# EAGLE design untitled (EAGLE 9.6.2)

## Sheet 1 of 2
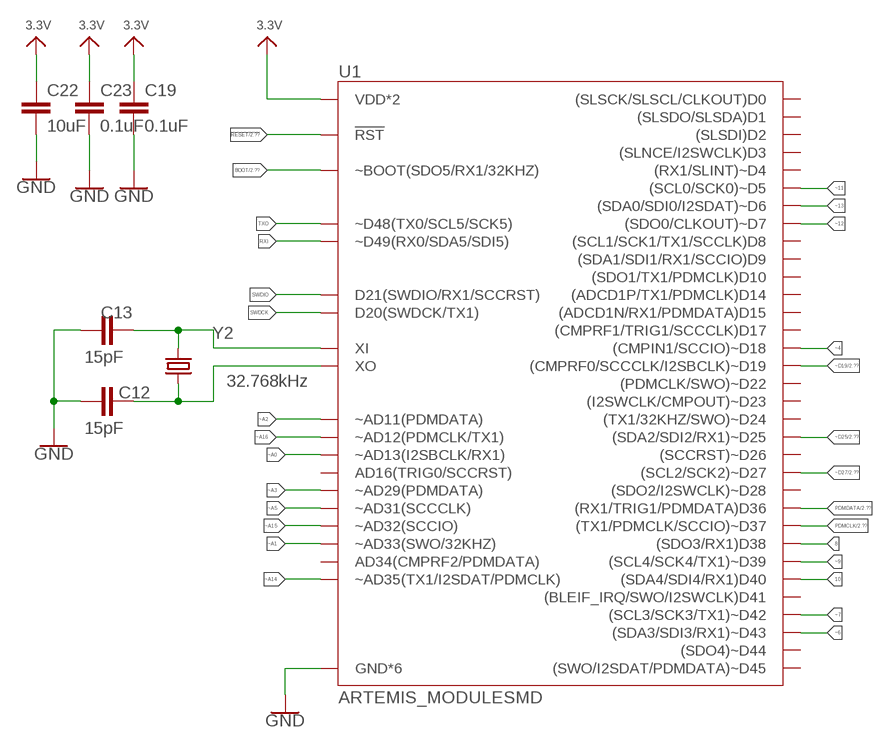
[diagram p0: schematic, sheet 1, part 1 of 2]
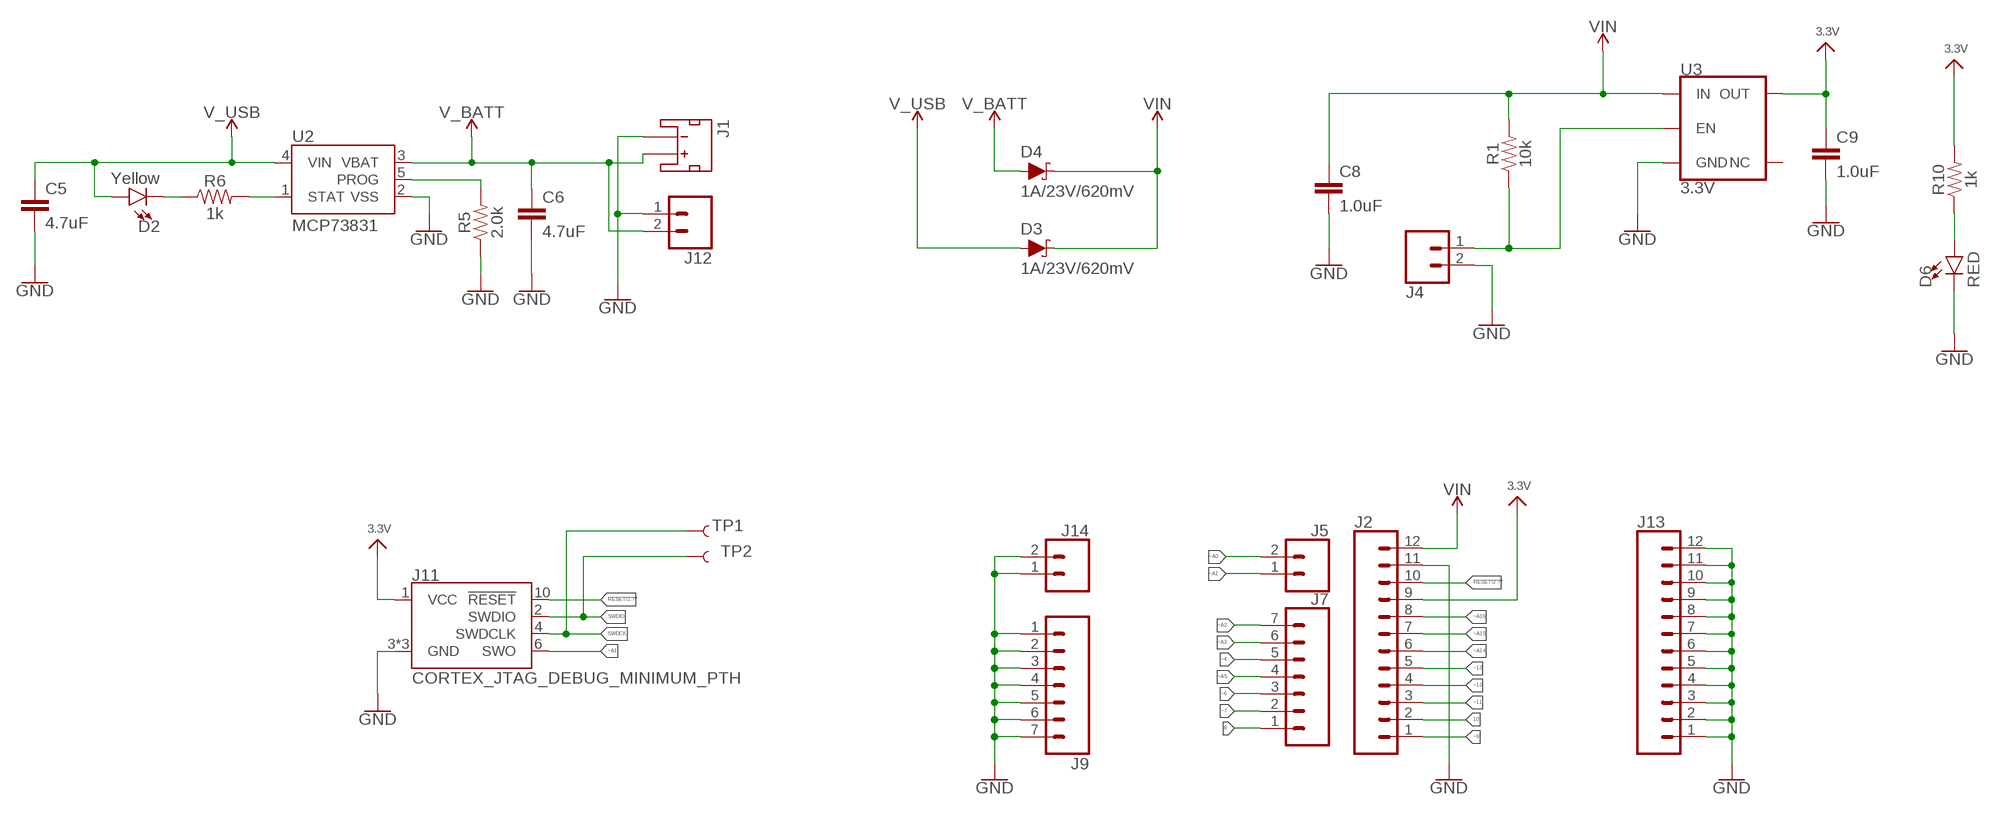
[diagram p1: schematic, sheet 1, part 2 of 2]

### Parts
C5  4.7uF  4.7UF-0603-6.3V-(10%)  [0603]
C6  4.7uF  4.7UF-0603-6.3V-(10%)  [0603]
C8  1.0uF  1.0UF-0402T-16V-10%  [0402-TIGHT]
C9  1.0uF  1.0UF-0402T-16V-10%  [0402-TIGHT]
C12  15pF  15PF-0603-50V-5%  [0603]
C13  15pF  15PF-0603-50V-5%  [0603]
C19  0.1uF  0.1UF-0402T-16V-10%  [0402-TIGHT]
C22  10uF  10UF-0603-6.3V-20%  [0603]
C23  0.1uF  0.1UF-0402T-16V-10%  [0402-TIGHT]
D2  Yellow  LED-YELLOW0603  [LED-0603]
D3  1A/23V/620mV  DIODE-SCHOTTKY-BAT20J  [SOD-323]
D4  1A/23V/620mV  DIODE-SCHOTTKY-BAT20J  [SOD-323]
D6  RED  LED-RED0603  [LED-0603]
J1  JST_2MM_MALE  [JST-2-SMD]
J2  CONN_12NO_SILK  [1X12_NO_SILK]
J4  CONN_021X02_NO_SILK  [1X02_NO_SILK]
J5  CONN_021X02_NO_SILK  [1X02_NO_SILK]
J7  CONN_07NO_SILK  [1X07_NO_SILK]
J9  CONN_07NO_SILK  [1X07_NO_SILK]
J11  CORTEX_JTAG_DEBUG_MINIMUM_PTH  [2X5-PTH-1.27MM]
J12  CONN_021X02_NO_SILK  [1X02_NO_SILK]
J13  CONN_12NO_SILK  [1X12_NO_SILK]
J14  CONN_021X02_NO_SILK  [1X02_NO_SILK]
R1  10k  10KOHM-0603-1/10W-1%  [0603]
R5  2.0k  2.0KOHM-0603-1/10W-5%  [0603]
R6  1k  1KOHM-0603-1/10W-1%  [0603]
R10  1k  1KOHM-0603-1/10W-1%  [0603]
TP1  TEST-POINT3X5  [PAD.03X.05]
TP2  TEST-POINT3X5  [PAD.03X.05]
U1  ARTEMIS_MODULESMD  [ARTEMIS_FP]
U2  MCP73831  [SOT23-5]
U3  3.3V  V_REG_AP2112K-3.3V  [SOT23-5]
Y2  32.768kHz  CRYSTAL-32.768KHZSMD-3.2X1.5  [CRYSTAL-SMD-3.2X1.5MM]

### Nets
3.3V: C9.1 C19.1 C22.1 C23.1 J2.9 J11.1(VCC) R10.2 U1.VDD@36(VDD*2) U1.VDD@37(VDD*2) U3.5(OUT) ; also sheet 2
8: J7.1 U1.D38((SDO3/RX1)D38)
10: J2.2 U1.D40((SDA4/SDI4/RX1)D40)
!RESET: J2.10 J11.10(!RESET) U1.~RST(!RST) ; also sheet 2
BOOT: U1.BOOT(~BOOT(SDO5/RX1/32KHZ)) ; also sheet 2
GND: C5.2 C6.2 C8.2 C9.2 C12.1 C13.1 C19.2 C22.2 C23.2 D6.C J1.1(-) J2.11 J4.2 J9.1 J9.2 J9.3 J9.4 J9.5 J9.6 J9.7 J11.3(GND) J11.5(GND) J11.9(GND) J12.1 J13.1 J13.2 J13.3 J13.4 J13.5 J13.6 J13.7 J13.8 J13.9 J13.10 J13.11 J13.12 J14.1 J14.2 R5.1 U1.GND@1(GND*6) U1.GND@22(GND*6) U1.GND@38(GND*6) U1.GND@39(GND*6) U1.GND@47(GND*6) U1.GND@59(GND*6) U2.2(VSS) U3.2(GND) ; also sheet 2
N$1: D6.A R10.1
N$2: D2.C R6.1
N$3: R6.2 U2.1(STAT)
N$4: R5.2 U2.5(PROG)
N$5: J4.1 R1.1 U3.3(EN)
N$6: C13.2 U1.XI Y2.P$2
N$7: C12.2 U1.XO Y2.P$1
PDMCLK: U1.~D37((TX1/PDMCLK/SCCIO)~D37) ; also sheet 2
PDMDATA: U1.D36((RX1/TRIG1/PDMDATA)D36) ; also sheet 2
RXI: U1.RXI-0(~D49(RX0/SDA5/SDI5))
SWDCK: J11.4(SWDCLK) TP1.1 U1.SWDCK(D20(SWDCK/TX1))
SWDIO: J11.2(SWDIO) TP2.1 U1.SWDIO(D21(SWDIO/RX1/SCCRST))
TXO: U1.TXO-0(~D48(TX0/SCL5/SCK5))
V_BATT: C6.1 D4.A J1.2(+) J12.2 U2.3(VBAT)
V_USB: C5.1 D2.A D3.A U2.4(VIN) ; also sheet 2
VIN: C8.1 D3.C D4.C J2.12 R1.2 U3.1(IN)
~4: J7.5 U1.~D18((CMPIN1/SCCIO)~D18)
~6: J7.3 U1.~D43((SDA3/SDI3/RX1)~D43)
~7: J7.2 U1.~D42((SCL3/SCK3/TX1)~D42)
~9: J2.1 U1.~D39((SCL4/SCK4/TX1)~D39)
~11: J2.3 U1.~D5((SCL0/SCK0)~D5)
~12: J2.4 U1.D7((SDO0/CLKOUT)~D7)
~13: J2.5 U1.~D6((SDA0/SDI0/I2SDAT)~D6)
~A0: J5.2 U1.~AD13(~AD13(I2SBCLK/RX1))
~A1: J5.1 J11.6(SWO) U1.~AD33/SWO(~AD33(SWO/32KHZ))
~A2: J7.7 U1.~AD11(~AD11(PDMDATA))
~A3: J7.6 U1.~AD29(~AD29(PDMDATA))
~A5: J7.4 U1.~AD31(~AD31(SCCCLK))
~A14: J2.6 U1.~AD35(~AD35(TX1/I2SDAT/PDMCLK))
~A15: J2.7 U1.~AD32(~AD32(SCCIO))
~A16: J2.8 U1.~AD12(~AD12(PDMCLK/TX1))
~D19: U1.~D19((CMPRF0/SCCCLK/I2SBCLK)~D19) ; also sheet 2
~D25: U1.~D25((SDA2/SDI2/RX1)~D25) ; also sheet 2
~D27: U1.~D27((SCL2/SCK2)~D27) ; also sheet 2
Unconnected: J1.NC1(PAD1) J1.NC2(PAD2) U1.AD16(AD16(TRIG0/SCCRST)) U1.AD34(AD34(CMPRF2/PDMDATA)) U1.D0((SLSCK/SLSCL/CLKOUT)D0) U1.D1((SLSDO/SLSDA)D1) U1.D2((SLSDI)D2) U1.D3((SLNCE/I2SWCLK)D3) U1.D8((SCL1/SCK1/TX1/SCCLK)D8) U1.D9((SDA1/SDI1/RX1/SCCIO)D9) U1.D10((SDO1/TX1/PDMCLK)D10) U1.D14((ADCD1P/TX1/PDMCLK)D14) U1.D15((ADCD1N/RX1/PDMDATA)D15) U1.D17((CMPRF1/TRIG1/SCCCLK)D17) U1.D41((BLEIF_IRQ/SWO/I2SWCLK)D41) U1.~D4((RX1/SLINT)~D4) U1.~D22((PDMCLK/SWO)~D22) U1.~D23((I2SWCLK/CMPOUT)~D23) U1.~D24((TX1/32KHZ/SWO)~D24) U1.~D26((SCCRST)~D26) U1.~D28((SDO2/I2SWCLK)~D28) U1.~D44((SDO4)~D44) U1.~D45((SWO/I2SDAT/PDMDATA)~D45) U3.4(NC)

## Sheet 2 of 2
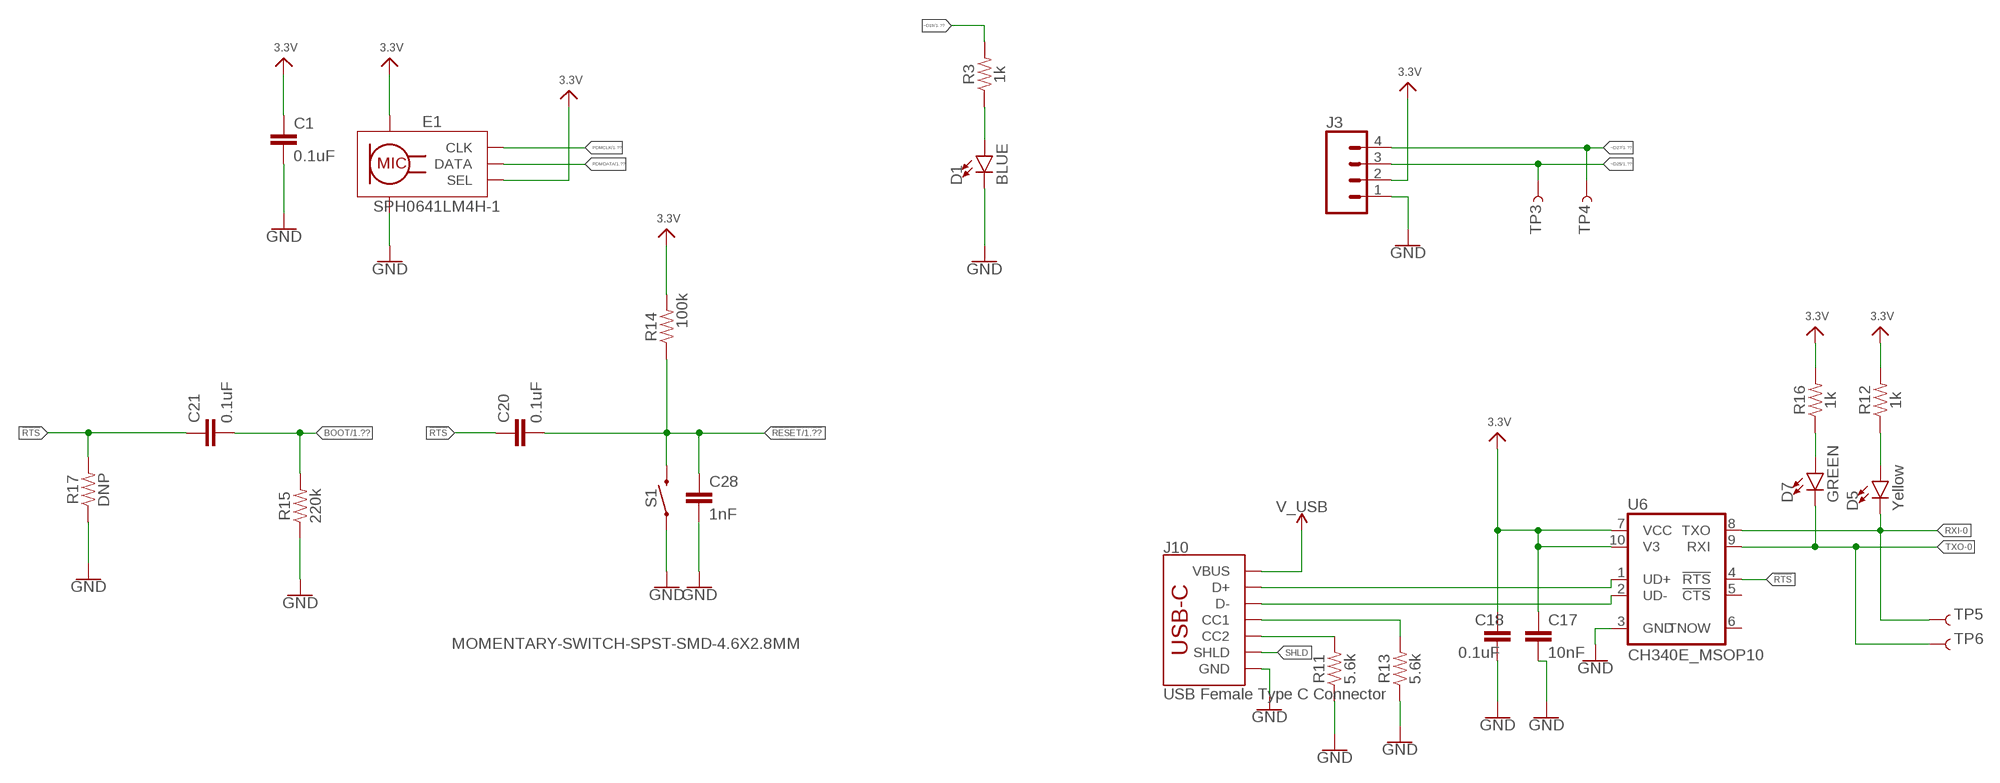
[diagram p2: schematic, sheet 2]

### Parts
C1  0.1uF  0.1UF-0402T-16V-10%  [0402-TIGHT]
C17  10nF  10NF-0603-50V-10%  [0603]
C18  0.1uF  0.1UF-0603-25V-(+80/-20%)  [0603]
C20  0.1uF  0.1UF-0603-25V-5%  [0603]
C21  0.1uF  0.1UF-0603-25V-5%  [0603]
C28  1nF  1.0NF/1000PF-0603-50V-10%  [0603]
D1  BLUE  LED-BLUE0603  [LED-0603]
D5  Yellow  LED-YELLOW0603  [LED-0603]
D7  GREEN  LED-GREEN0603  [LED-0603]
E1  SPH0641LM4H-1  SPH0641LM4H-1_MICROPHONE  [SPH0641LM4H-1_MICROPHONE]
J3  CONN_04SMD2  [JST04_1MM_RA]
J10  USB Female Type C Connector  USB_C_4-LAYER-ISOLATED  [USB-C-16P-4LAYER-ISOLATED]
R3  1k  1KOHM-0603-1/10W-1%  [0603]
R11  5.6k  5.6KOHM-0603-1/10W-1%  [0603]
R12  1k  1KOHM-0603-1/10W-1%  [0603]
R13  5.6k  5.6KOHM-0603-1/10W-1%  [0603]
R14  100k  100KOHM-0603-1/10W-1%  [0603]
R15  220k  220KOHM-0603-1/10W-1%  [0603]
R16  1k  1KOHM-0603-1/10W-1%  [0603]
R17  DNP  DNP-0603  [0603]
S1  MOMENTARY-SWITCH-SPST-SMD-4.6X2.8MM  [TACTILE_SWITCH_SMD_4.6X2.8MM]
TP3  TEST-POINT3X5  [PAD.03X.05]
TP4  TEST-POINT3X5  [PAD.03X.05]
TP5  TEST-POINT3X5  [PAD.03X.05]
TP6  TEST-POINT3X5  [PAD.03X.05]
U6  CH340E_MSOP10  [MSOP10]

### Nets
3.3V: C1.1 C17.1 C18.1 E1.2(SEL) E1.5(VDD) J3.2 R12.2 R14.2 R16.2 U6.7(VCC) U6.10(V3) ; also sheet 1
!RESET: C20.2 C28.1 R14.1 S1.3 S1.4 ; also sheet 1
!RTS: C20.1 C21.1 R17.2 U6.4(!RTS)
BOOT: C21.2 R15.2 ; also sheet 1
GND: C1.2 C17.2 C18.2 C28.2 D1.C E1.3(GND) E1.6(GND) E1.7(GND) E1.8(GND) J3.1 J10.GND J10.GND2(GND) R11.1 R13.1 R15.1 R17.1 S1.1 S1.2 U6.3(GND) ; also sheet 1
N$8: J10.A6(D+) J10.B6(D+) U6.1(UD+)
N$9: D1.A R3.1
N$10: J10.A7(D-) J10.B7(D-) U6.2(UD-)
N$11: J10.B5(CC2) R11.2
N$12: J10.A5(CC1) R13.2
N$13: D7.A R16.1
N$14: D5.A R12.1
PDMCLK: E1.4(CLK) ; also sheet 1
PDMDATA: E1.1(DATA) ; also sheet 1
RXI-0: D5.C TP5.1 U6.8(TXO)
SHLD: J10.SHLD1(SHLD) J10.SHLD2(SHLD) J10.SHLD3(SHLD) J10.SHLD4(SHLD) J10.SHLD5(SHLD) J10.SHLD6(SHLD) J10.SHLD7(SHLD) J10.SHLD8(SHLD)
TXO-0: D7.C TP6.1 U6.9(RXI)
V_USB: J10.VBUS1(VBUS) J10.VBUS2(VBUS) ; also sheet 1
~D19: R3.2 ; also sheet 1
~D25: J3.3 TP3.1 ; also sheet 1
~D27: J3.4 TP4.1 ; also sheet 1
Unconnected: U6.5(!CTS) U6.6(TNOW)

## Library data of the parts
C1 C19 C23 = SparkFun-Capacitors:0.1UF: 0.1µF ceramic capacitors A capacitor is a passive two-terminal electrical component used to store electrical energy temporarily in an electric field.; PROD_ID: CAP-12416
C5 C6 = SparkFun-Capacitors:4.7UF: 4.7µF ceramic capacitors A capacitor is a passive two-terminal electrical component used to store electrical energy temporarily in an electric field.; PROD_ID: CAP-08280
C8 C9 = SparkFun-Capacitors:1.0UF: 1µF ceramic capacitors A capacitor is a passive two-terminal electrical component used to store electrical energy temporarily in an electric field.; PROD_ID: CAP-12417
C12 C13 = SparkFun-Capacitors:15PF: 15pF ceramic capacitors A capacitor is a passive two-terminal electrical component used to store electrical energy temporarily in an electric field.; PROD_ID: CAP-07881
C17 = SparkFun-Capacitors:10NF: 0.01uF/10nF/10,000pF ceramic capacitors A capacitor is a passive two-terminal electrical component used to store electrical energy temporarily in an electric field. CAP-09321; PROD_ID: CAP-00867
C18 = SparkFun-Capacitors:0.1UF: 0.1µF ceramic capacitors A capacitor is a passive two-terminal electrical component used to store electrical energy temporarily in an electric field.; PROD_ID: CAP-00810
C20 C21 = SparkFun-Capacitors:0.1UF: 0.1µF ceramic capacitors A capacitor is a passive two-terminal electrical component used to store electrical energy temporarily in an electric field.; PROD_ID: CAP-08604
C22 = SparkFun-Capacitors:10UF: 10.0µF ceramic capacitors A capacitor is a passive two-terminal electrical component used to store electrical energy temporarily in an electric field.; PROD_ID: CAP-11015
C28 = SparkFun-Capacitors:1.0NF/1000PF: 1nF/1,000pF ceramic capacitors A capacitor is a passive two-terminal electrical component used to store electrical energy temporarily in an electric field.; PROD_ID: CAP-07886
D1 = SparkFun-LED:LED-BLUE: Blue SMD LED Used in manufacturing of various products at SparkFun Packages: 0603 - SMD 0603 package [Product Link] <http://www.digikey.com/product-detail/en/SMLE12BC7TT86/511-1589-2-ND/1641808> 1206 - SMD1206 package [Product Link] <http://www.digikey.com/product-detail/en/lite-on-inc/LTST-C150TBKT/160-1643-1-ND/573584> SparkFun Products: ESP8266 Thing-Dev Board <https://www.sparkfun.com/products/13711> RedBoard <https://www.sparkfun.com/products/12757>; PROD_ID: DIO-08575
D2 D5 = SparkFun-LED:LED-YELLOW: Yellow SMD LED Used in manufacturing several products at SparkFun. Packages: 0603 - SMD 0603 package[Product Link] <http://www.kingbrightusa.com/product.asp?catalog_name=LED&product_id=APT1608SYCK> 0603 -SMART - SMART SMD 0603 package (more efficient/more expensive) [Product Link] <http://www.osram-os.com/osram_os/en/products/product-catalog/led-light-emitting-diodes/smartled-0603/ly-l29k/index.jsp> LilyPad - SMD1206 package[Product Datasheet] <https://www.sparkfun.com/datasheets/DevTools/LilyPad/Q150YUS4.pdf> SparkFun Products: Blynk Board <https://www.sparkfun.com/products/13794> IOIO-OTG <https://www.sparkfun.com/products/13613> XBee Explorer Serial <https://www.sparkfun.com/products/13225>; PROD_ID: DIO-09003
D3 D4 = SparkFun-DiscreteSemi:DIODE-SCHOTTKY: Schottky diode A Schottky diode is a semiconductor diode which has a low forward voltage drop and a very fast switching action.; PROD_ID: DIO-11623
D6 = SparkFun-LED:LED-RED: Red SMD LED Used in manufacturing of most products at SparkFun Packages: 0603 - SMD 0603 package [Product Link] <http://docs.avagotech.com/docs/AV02-0551EN> 0603 SMART - SMD 0603 SMART package ( more efficient and expensive)[Product Link] <http://www.osram-os.com/Graphics/XPic2/00077099_0.pdf> 1206 - SMD1206 package [Product Link] <https://www.sparkfun.com/datasheets/DevTools/LilyPad/Q150OVS4.pdff> SparkFun Products: Pro Mini 328 -5V <https://www.sparkfun.com/products/821> RedBoard <https://www.sparkfun.com/products/12757> IOIO-OTG <https://www.sparkfun.com/products/13613>; PROD_ID: DIO-00819
D7 = SparkFun-LED:LED-GREEN: Green SMD LED Used in manufacturing of various products at SparkFun Packages: 0603 - SMD 0603 package [Product Link] <http://www.futureelectronics.com/en/technologies/semiconductors/optoelectronics/leds/Pages/9894312-LTST-C190GKT.aspx?CrossPart=HSMG-C190&IM=0> LilyPad 1206 - SMD1206 LilyPad package [Product Link] <http://www.futureelectronics.com/en/Technologies/Product.aspx?ProductID=IN150NGHARVATEKCORPORATION2049943&IM=0> 1206 - SMD1206 package [Product Link] <http://www.futureelectronics.com/en/technologies/semiconductors/optoelectronics/leds/Pages/8315665-LTST-C150KGKT.aspx?IM=0> 1206 Bottom Mount -SMD 1206 Bottom Mount [Product Link] <http://www.digikey.com/product-detail/en/lite-on-inc/LTST-C230KGKT/160-1456-1-ND/386854> SparkFun Products: Pro Mini 328 -5V <https://www.sparkfun.com/products/821> RedBoard <https://www.sparkfun.com/products/12757> MP3 Trigger <https://www.sparkfun.com/products/13720> Makey Makey <https://www.sparkfun.com/products/11076>; PROD_ID: DIO-00821
E1 = SparkFun-Sensors:SPH0641LM4H-1_MICROPHONE: SPH0641LM4H-1 Microphone A miniature, high-performance, low power, bottom port silicon digital microphone with a single bit PDM output.; PROD_ID: IC-14361
J1 = SparkFun-Connectors:JST_2MM_MALE: JST 2MM MALE RA CONNECTOR Two pin, compact surface mount connector. Commonly used as a battery input connection point. We really like the solid locking feeling and high current rating on these small connectors. We use these all the time as battery connectors. Mates to single-cell LiPo batteries. Here is the connector we sell at SparkFun: JST Right Angle Connector - White <https://www.sparkfun.com/products/8612> (PRT-08612) Datasheet <http://www.sparkfun.com/datasheets/Prototyping/Connectors/JST-Horizontal.pdf> It was used on these SparkFun products: SparkFun MOSFET Power Controller <https://www.sparkfun.com/products/11214> (PRT-11214) SparkFun Battery Babysitter - LiPo Battery Manager <https://www.sparkfun.com/products/13777> (PRT-13777) And many, many others that required a lipo battery connection.; PROD_ID: CONN-11443; SF_ID: PRT-08612
J2 J13 = SparkFun-Connectors:CONN_12: Multi connection point. Often used as Generic Header-pin footprint for 0.1 inch spaced/style header connections On any of the 0.1 inch spaced packages, you can populate with these: Break Away Headers - Straight <https://www.sparkfun.com/products/116> (PRT-00116) Break Away Male Headers - Right Angle <https://www.sparkfun.com/products/553> (PRT-00553) Female Headers <https://www.sparkfun.com/products/115> (PRT-00115) Break Away Headers - Machine Pin <https://www.sparkfun.com/products/117> (PRT-00117) Break Away Female Headers - Swiss Machine Pin <https://www.sparkfun.com/products/743> (PRT-00743) For SCREWTERMINALS and SPRING TERMINALS visit here: Screw Terimnals on SparkFun.com <https://www.sparkfun.com/search/results?term=Screw+Terminals> (5mm/3.5mm/2.54mm spacing) This device is also useful as a general connection point to wire up your design to another part of your project. Our various solder wires solder well into these plated through hole pads. Hook-Up Wire - Assortment (Stranded, 22 AWG) <https://www.sparkfun.com/products/11375> (PRT-11375) Hook-Up Wire - Assortment (Solid Core, 22 AWG) <https://www.sparkfun.com/products/11367> (PRT-11367) View the entire wire category on our website here <https://www.sparkfun.com/categories/141> Special notes: Molex polarized connector foot print use with SKU : PRT-08231 with associated crimp pins and housings. 1MM SMD Version SKU: PRT-10208 NOTES ON THE VARIANTS LOCK and LOCK_LONGPADS... This footprint was designed to help hold the alignment of a through-hole component (i.e. 6-pin header) while soldering it into place. You may notice that each hole has been shifted either up or down by 0.005 of an inch from it's more standard position (which is a perfectly straight line). This slight alteration caused the pins (the squares in the middle) to touch the edges of the holes. Because they are alternating, it causes a "brace" to hold the component in place. 0.005 has proven to be the perfect amount of "off-center" position when using our standard breakaway headers. Although looks a little odd when you look at the bare footprint, once you have a header in there, the alteration is very hard to notice. Also,if you push a header all the way into place, it is covered up entirely on the bottom side.
J3 = SparkFun-Connectors:CONN_04: Multi connection point. Often used as Generic Header-pin footprint for 0.1 inch spaced/style header connections On any of the 0.1 inch spaced packages, you can populate with these: Break Away Headers - Straight <https://www.sparkfun.com/products/116> (PRT-00116) Break Away Male Headers - Right Angle <https://www.sparkfun.com/products/553> (PRT-00553) Female Headers <https://www.sparkfun.com/products/115> (PRT-00115) Break Away Headers - Machine Pin <https://www.sparkfun.com/products/117> (PRT-00117) Break Away Female Headers - Swiss Machine Pin <https://www.sparkfun.com/products/743> (PRT-00743) For SCREWTERMINALS and SPRING TERMINALS visit here: Screw Terimnals on SparkFun.com <https://www.sparkfun.com/search/results?term=Screw+Terminals> (5mm/3.5mm/2.54mm spacing) This device is also useful as a general connection point to wire up your design to another part of your project. Our various solder wires solder well into these plated through hole pads. Hook-Up Wire - Assortment (Stranded, 22 AWG) <https://www.sparkfun.com/products/11375> (PRT-11375) Hook-Up Wire - Assortment (Solid Core, 22 AWG) <https://www.sparkfun.com/products/11367> (PRT-11367) View the entire wire category on our website here <https://www.sparkfun.com/categories/141> Special notes: Molex polarized connector foot print use with SKU : PRT-08231 with associated crimp pins and housings. 1MM SMD Version SKU: PRT-10208; PROD_ID: CONN-10310; SF_ID: PRT-10208
J4 J5 J12 J14 = SparkFun-Connectors:CONN_02: Multi connection point. Often used as Generic Header-pin footprint for 0.1 inch spaced/style header connections On any of the 0.1 inch spaced packages, you can populate with these: Break Away Headers - Straight <https://www.sparkfun.com/products/116> (PRT-00116) Break Away Male Headers - Right Angle <https://www.sparkfun.com/products/553> (PRT-00553) Female Headers <https://www.sparkfun.com/products/115> (PRT-00115) Break Away Headers - Machine Pin <https://www.sparkfun.com/products/117> (PRT-00117) Break Away Female Headers - Swiss Machine Pin <https://www.sparkfun.com/products/743> (PRT-00743) For SCREWTERMINALS and SPRING TERMINALS visit here: Screw Terimnals on SparkFun.com <https://www.sparkfun.com/search/results?term=Screw+Terminals> (5mm/3.5mm/2.54mm spacing) This device is also useful as a general connection point to wire up your design to another part of your project. Our various solder wires solder well into these plated through hole pads. Hook-Up Wire - Assortment (Stranded, 22 AWG) <https://www.sparkfun.com/products/11375> (PRT-11375) Hook-Up Wire - Assortment (Solid Core, 22 AWG) <https://www.sparkfun.com/products/11367> (PRT-11367) View the entire wire category on our website here <https://www.sparkfun.com/categories/141> Special notes: Molex polarized connector foot print use with: PRT-08233 with associated crimp pins and housings. 2.54_SCREWTERM for use with PRT-10571. 3.5mm Screw Terminal footprints for PRT-08084 5mm Screw Terminal footprints for use with PRT-08432
J7 J9 = SparkFun-Connectors:CONN_07: Multi connection point. Often used as Generic Header-pin footprint for 0.1 inch spaced/style header connections On any of the 0.1 inch spaced packages, you can populate with these: Break Away Headers - Straight <https://www.sparkfun.com/products/116> (PRT-00116) Break Away Male Headers - Right Angle <https://www.sparkfun.com/products/553> (PRT-00553) Female Headers <https://www.sparkfun.com/products/115> (PRT-00115) Break Away Headers - Machine Pin <https://www.sparkfun.com/products/117> (PRT-00117) Break Away Female Headers - Swiss Machine Pin <https://www.sparkfun.com/products/743> (PRT-00743) For SCREWTERMINALS and SPRING TERMINALS visit here: Screw Terimnals on SparkFun.com <https://www.sparkfun.com/search/results?term=Screw+Terminals> (5mm/3.5mm/2.54mm spacing) This device is also useful as a general connection point to wire up your design to another part of your project. Our various solder wires solder well into these plated through hole pads. Hook-Up Wire - Assortment (Stranded, 22 AWG) <https://www.sparkfun.com/products/11375> (PRT-11375) Hook-Up Wire - Assortment (Solid Core, 22 AWG) <https://www.sparkfun.com/products/11367> (PRT-11367) View the entire wire category on our website here <https://www.sparkfun.com/categories/141> Special notes: Molex polarized connector foot print use with SKU : PRT-08231 with associated crimp pins and housings. 1MM SMD Version SKU: PRT-10208 NOTES ON THE VARIANTS LOCK and LOCK_LONGPADS... This footprint was designed to help hold the alignment of a through-hole component (i.e. 6-pin header) while soldering it into place. You may notice that each hole has been shifted either up or down by 0.005 of an inch from it's more standard position (which is a perfectly straight line). This slight alteration caused the pins (the squares in the middle) to touch the edges of the holes. Because they are alternating, it causes a "brace" to hold the component in place. 0.005 has proven to be the perfect amount of "off-center" position when using our standard breakaway headers. Although looks a little odd when you look at the bare footprint, once you have a header in there, the alteration is very hard to notice. Also,if you push a header all the way into place, it is covered up entirely on the bottom side.
J10 = SparkFun-Connectors:USB_C: USB Type C 16Pin Connector Super Speed pins not available on the 16-pin purely SMD connector so this part is best for USB 2.0 implementations. D1 and D2 are tied together enabling D+/- no matter which way the cable is plugged into the connector. The two channel configuration pins (CC1/2) are exposed. These are normally connected to ground via 5.1k resistors but can be reconfigured for high current/high power applications. **4-LAYER BOARD WARNING!!** If designing 4-layer board, make sure to select the variant _4-LAYER-ISOLATED. The linked footprint (USB-C-16-4LAYER-ISOLATED) includes some very necessary cutout polygons in the inner layers (2 and 15). This prevents the PTH mounting shield legs on the USB connector from electrically connecting any other polygons on the inner layers (usually VCC and GND).; PROD_ID: CONN-14122
J11 = SparkFun-Connectors:CORTEX_JTAG_DEBUG_MINIMUM: Cortex Debug Connector - 10 pin Supports JTAG debug, Serial Wire debug, and Serial Wire Viewer. PTH and SMD connector options available. General Connector Information <http://infocenter.arm.com/help/topic/com.arm.doc.faqs/attached/13634/cortex_debug_connectors.pdf> Products: PTH Connector <http://www.digikey.com/product-detail/en/cnc-tech/3220-10-0100-00/1175-1627-ND/3883661> -via Digi-Key SparkFun PSoc <https://www.sparkfun.com/products/13229> SparkFun T <https://www.sparkfun.com/products/13810>
R1 = SparkFun-Resistors:10KOHM: 10kΩ resistor A resistor is a passive two-terminal electrical component that implements electrical resistance as a circuit element. Resistors act to reduce current flow, and, at the same time, act to lower voltage levels within circuits. - Wikipedia; PROD_ID: RES-00824
R3 R6 R10 R12 R16 = SparkFun-Resistors:1KOHM: 1kΩ resistor A resistor is a passive two-terminal electrical component that implements electrical resistance as a circuit element. Resistors act to reduce current flow, and, at the same time, act to lower voltage levels within circuits. - Wikipedia; PROD_ID: RES-07856
R5 = SparkFun-Resistors:2.0KOHM: 2kΩ resistor A resistor is a passive two-terminal electrical component that implements electrical resistance as a circuit element. Resistors act to reduce current flow, and, at the same time, act to lower voltage levels within circuits. - Wikipedia; PROD_ID: RES-08296
R11 R13 = SparkFun-Resistors:5.6KOHM: 5.6kΩ resistor A resistor is a passive two-terminal electrical component that implements electrical resistance as a circuit element. Resistors act to reduce current flow, and, at the same time, act to lower voltage levels within circuits. - Wikipedia; PROD_ID: RES-12378
R14 = SparkFun-Resistors:100KOHM: 100kΩ resistor A resistor is a passive two-terminal electrical component that implements electrical resistance as a circuit element. Resistors act to reduce current flow, and, at the same time, act to lower voltage levels within circuits. - Wikipedia; PROD_ID: RES-07828
R15 = SparkFun-Resistors:220KOHM: 220kΩ resistor A resistor is a passive two-terminal electrical component that implements electrical resistance as a circuit element. Resistors act to reduce current flow, and, at the same time, act to lower voltage levels within circuits. - Wikipedia; PROD_ID: RES-08969
R17 = SparkFun-Resistors:DNP: Do-Not-Populate resistor A resistor is a passive two-terminal electrical component that implements electrical resistance as a circuit element. Resistors act to reduce current flow, and, at the same time, act to lower voltage levels within circuits. - Wikipedia
S1 = SparkFun-Switches:MOMENTARY-SWITCH-SPST: Momentary Switch (Pushbutton) - SPST Normally-open (NO) SPST momentary switches (buttons, pushbuttons). Variants PTH-12MM - 12mm square, through-hole Momentary Pushbutton Switch - 12mm Square <https://www.sparkfun.com/products/9190> (COM-09190) PTH-6.0MM, PTH-6.0MM-KIT - 6.0mm square, through-hole Mini Pushbutton Switch <https://www.sparkfun.com/products/97> (COM-00097) KIT package intended for soldering kit's - only one side of pads' copper is exposed. PTH-RIGHT-ANGLE-KIT - Right-angle, through-hole Right Angle Tactile Button <https://www.sparkfun.com/products/10791> - Used on SparkFun BigTime Watch Kit <https://www.sparkfun.com/products/11734> SMD-12MM - 12mm square, surface-mount Tactile Button - SMD (12mm) <https://www.sparkfun.com/products/12993> (COM-12993) Used on SparkFun PicoBoard <https://www.sparkfun.com/products/11888> SMD-4.5MM - 4.5mm Square Trackball Switch Used on SparkFun Blackberry Trackballer Breakout <https://www.sparkfun.com/products/13169> SMD-4.6MMX2.8MM - 4.60mm x 2.80mm, surface mount Used on SparkFun Pro Micro - RP2040 <https://www.sparkfun.com/products/17717> SMD-5.2MM, SMD-5.2-REDUNDANT - 5.2mm square, surface-mount Mini Pushbutton Switch - SMD <https://www.sparkfun.com/products/8720> (COM-08720) Used on Arduino Pro Mini <https://www.sparkfun.com/products/11114> REDUNDANT package connects both switch circuits together SMD-6.0X3.5MM - 6.0 x 3.5mm, surface mount Momentary Reset Switch SMD <https://www.sparkfun.com/products/8229> (COM-08229) SMD-6.2MM-TALL - 6.2mm square, surface mount Tactile Button - SMD (6mm) <https://www.sparkfun.com/products/12992> Used on SparkFun Digital Sandbox <https://www.sparkfun.com/products/12651> SMD-RIGHT-ANGLE - Right-angle, surface mount Used on SparkFun Block for Intel® Edison - Arduino <https://www.sparkfun.com/products/13036>; PROD_ID: SWCH-15606
TP1-TP6 = SparkFun-Connectors:TEST-POINT: SparkFun Test Points Bare copper test points for troubleshooting or In-Circuit-Testing. These are used by our Production team for verifying production board runs using pogo-pins on test beds. SparkFun Products: SparkFun LSM9DS1 Breakout <https://www.sparkfun.com/products/13284> SparkFun PSOC <https://www.sparkfun.com/products/13714> SparkFun Load Cell Amplifier <https://www.sparkfun.com/products/13879>
U1 = SparkFun-IC-Microcontroller:ARTEMIS_MODULE: Description: The Artemis Module from SparkFun is a Cortex-M4F with BLE 5.0 running up to 96MHz and with as low power as 6uA per MHz (less than 5mW). This is the world's first module to bridge the market between hobbyists and consumer products. We've packaged all the power of a modern microcontroller into a module that is both extremely easy to use but is mass-market ready. The flexibility of the Artemis module starts with our [Arduino core](https://github.com/sparkfun/Arduino_Apollo3). You can program and use the Artemis module just like you would an Uno or any other Arduino. Time to first blink is just 5 minutes away! We built the core from the ground up, making it fast and as light weight as possible.; PROD_ID: SUB-14402
U2 = SparkFun-IC-Power:MCP73831: MCP73831T Li-Ion, Li-Pol Controller Miniature single cell, fully integrated Li-Ion, Li-polymer charge management controller Datasheet <http://ww1.microchip.com/downloads/en/DeviceDoc/20001984g.pdf> SparkFun Products: SparkFun ESP32 Thing <https://www.sparkfun.com/products/13907> SparkFun 9DoF Razor IMU M0 <https://www.sparkfun.com/products/14001>; PROD_ID: IC-09995
U3 = SparkFun-IC-Power:V_REG_AP2112: AP2112 - 600mA CMOS LDO Regulator w/ Enable The AP2112 is CMOS process low dropout linear regulator with enable function, the regulator delivers a guaranteed 600mA (min.) continuous load current. Features Output Voltage Accuracy: ±1.5% Output Current: 600mA (Min.) Foldback Short Current Protection: 50mA Enable Function to Turn ON/OFF VOUT Low Dropout Voltage (3.3V): 250mV (Typ.) @IOUT=600mA Excellent Load Regulation: 0.2%/A (Typ.) Excellent Line Regulation: 0.02%/V (Typ.) Low Quiescent Current: 55μA (Typ.) Low Standby Current: 0.01μA (Typ.) Low Output Noise: 50μVRMS PSRR: 100Hz -65dB, 1kHz -65dB OTSD Protection Stable with 1.0μF Flexible Cap: Ceramic, Tantalum and Aluminum Electrolytic Operation Temperature Range: -40°C to 85°C ESD: MM 400V, HBM 4000V; PROD_ID: VREG-12457
U6 = SparkFun-IC-Comms:CH340E; PROD_ID: IC-14135
Y2 = SparkFun-Clocks:CRYSTAL-32.768KHZ: 32.768kHz Crystal Frequency: 32.768kHz Frequency Stability: ±20ppm Load Capacitance: 12.5pF (PTH-2X6 & SMD-3.2X1.5), 6pF (SMD-2X6) SparkFun Products: SparkFun BigTime Watch Kit <https://www.sparkfun.com/products/11734> SparkFun nRF52832 Breakout <https://www.sparkfun.com/products/13990> SparkFun Real Time Clock Module <https://www.sparkfun.com/products/12708>; PROD_ID: XTAL-13062

## Board
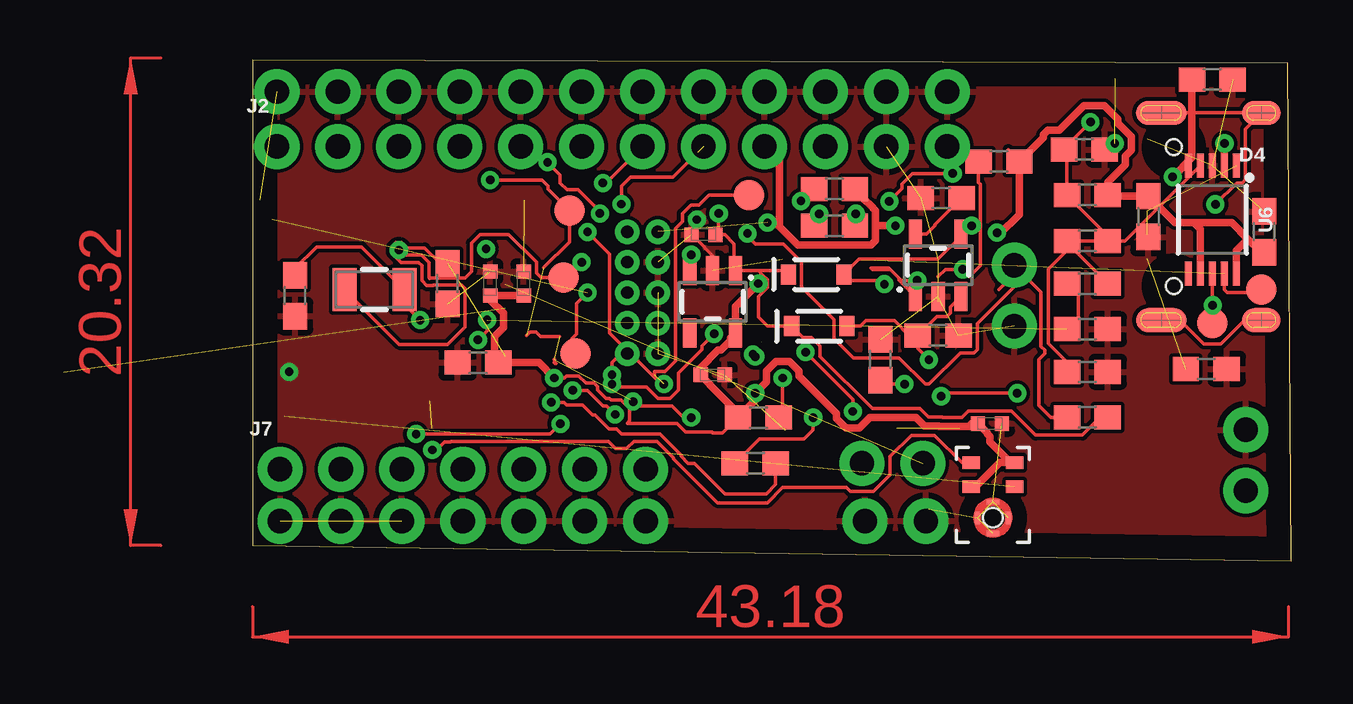
[diagram p3: board, top side]
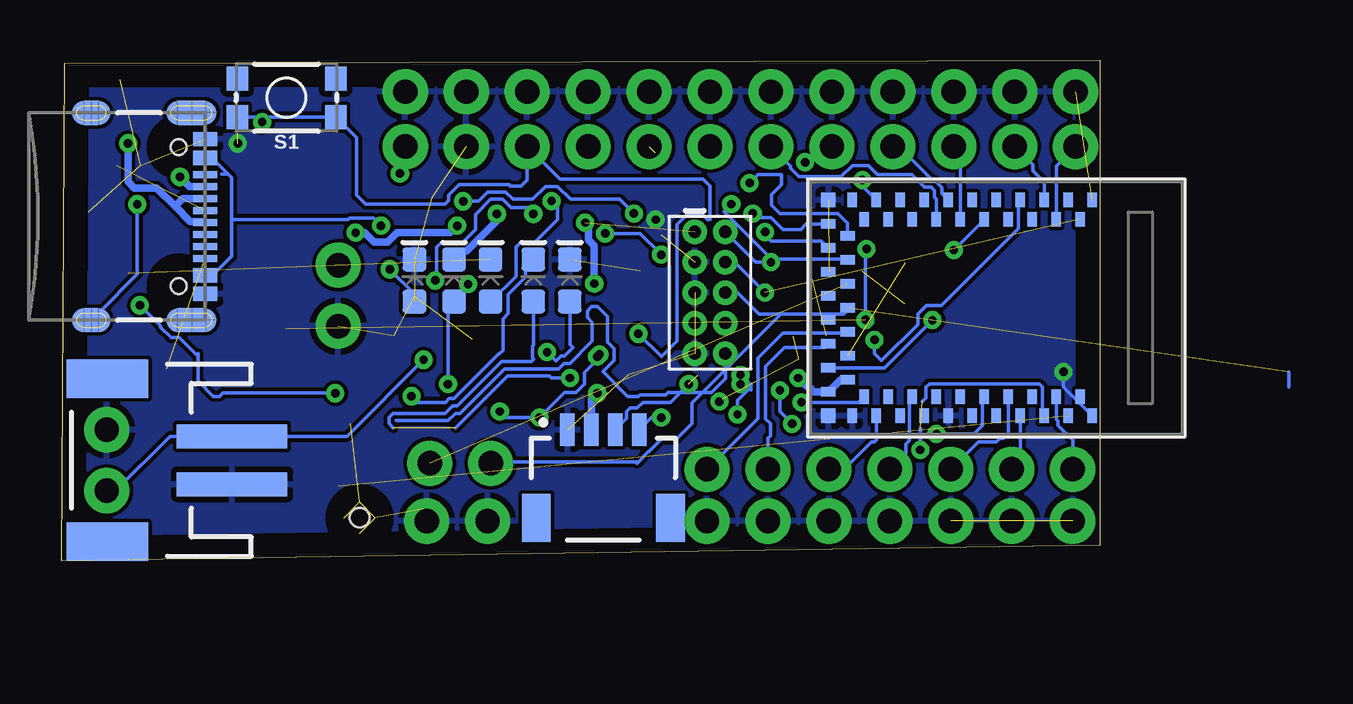
[diagram p4: board, bottom side, seen from below]

Size 43.29 x 20.88 mm. Coordinates in mm from the lower left corner, seen from the top.
Outline: 0,0.64 43.29,0 43.16,20.75 0,20.88 0,0.64
Copper layers (1*16): Top 0.035mm / dielectric 1.5mm / Bottom 0.035mm
Design rules "default": minimum track width 6mil, minimum drill 0.35mm, track to track 6mil, track to pad 6mil, pad to pad 6mil, via to via 6mil, smd to smd 6mil, copper to edge 40mil, drill to drill 6mil, minimum pad ring 10mil, minimum via ring 8mil, stop-mask expansion 4mil, vias tented up to drill 0mil, thermal gap 10mil

### Footprints (pad centres in the part's own frame; a part is rotated, then mirrored left to right if it is on the bottom)
0402-TIGHT = smd 0.6 x 0.6: 1 -0.5,0; 2 0.5,0
0603 = smd 1.1 x 1: 1 -0.85,0; 2 0.85,0
LED-0603 = smd 1 x 1: A -0.877,0; C 0.877,0
SOD-323 = smd 0.63 x 0.83: A 1.15,0; C -1.15,0
SPH0641LM4H-1_MICROPHONE = smd 0.725 x 0.522: 1 -0.9,1.3; 2 -0.9,0.3; 4 0.9,0.3; 5 0.9,1.3 | smd 0.5 x 0.2: 3 0,-1.65; 8 0,-0.35 | smd 0.2 x 0.5: 6 -0.65,-1; 7 0.65,-1 | hole 0.8: 0,-1
JST-2-SMD = smd 1 x 4.6: 1 -1,-3.7; 2 1,-3.7 | smd 1.6 x 3.4: NC1 -3.4,1.5; NC2 3.4,1.5
1X12_NO_SILK = drill 1.016 pad 1.88: 1 0,0; 2 2.54,0; 3 5.08,0; 4 7.62,0; 5 10.16,0; 6 12.7,0; 7 15.24,0; 8 17.78,0; 9 20.32,0; 10 22.86,0; 11 25.4,0; 12 27.94,0
JST04_1MM_RA = smd 0.6 x 1.35: 1 -1.5,0; 2 -0.5,0; 3 0.5,0; 4 1.5,0 | smd 1.2 x 2: NC1 2.8,-3.675; NC2 -2.8,-3.675
1X02_NO_SILK = drill 1.016 pad 1.88: 1 0,0; 2 2.54,0
1X07_NO_SILK = drill 1.016 pad 1.88: 1 0,0; 2 2.54,0; 3 5.08,0; 4 7.62,0; 5 10.16,0; 6 12.7,0; 7 15.24,0
USB-C-16P-4LAYER-ISOLATED = smd 0.3 x 1: A5 -1.25,-0.34; A6 -0.25,-0.34; A7 0.25,-0.34; A8 1.25,-0.34; B5 1.75,-0.34; B6 0.75,-0.34; B7 -0.75,-0.34; B8 -1.75,-0.34 | smd 0.6 x 1: GND -3.225,-0.34; GND2 3.225,-0.34; VBUS1 -2.45,-0.34; VBUS2 2.45,-0.34 | smd 1 x 2.1: SHLD1 -4.32,-0.915; SHLD2 4.32,-0.915 | smd 1 x 2.1 bottom: SHLD3 -4.32,-0.915; SHLD4 4.32,-0.915 | smd 1 x 1.6: SHLD5 -4.32,-5.095; SHLD8 4.32,-5.095 | smd 1 x 1.6 bottom: SHLD6 -4.32,-5.095; SHLD7 4.32,-5.095 | hole 0.65: -2.89,-1.445; 2.89,-1.445
2X5-PTH-1.27MM = drill 0.508 pad 1: 1 -2.54,-0.635; 2 -2.54,0.635; 3 -1.27,-0.635; 4 -1.27,0.635; 5 0,-0.635; 6 0,0.635; 7 1.27,-0.635; 8 1.27,0.635; 9 2.54,-0.635; 10 2.54,0.635
TACTILE_SWITCH_SMD_4.6X2.8MM = smd 0.9 x 1: 1 -2.05,-0.8; 2 2.05,-0.8; 3 2.05,0.8; 4 -2.05,0.8
PAD.03X.05 = smd 1.27 x 1.27: 1 0,0
ARTEMIS_FP = smd 0.4 x 0.6: AD16 -4,-3.7; BOOT 1.5,4.5; D0 0.5,-4.5; D1 -0.5,-4.5; D2 -1,-3.7; D3 2,-3.7; D7 -1.5,4.5; D8 -0.5,4.5; D9 2,3.7; D10 1,3.7; D14 -5,3.7; D17 -3.5,-4.5; D36 2.5,-4.5; D38 3,-3.7; D40 2.5,4.5; D41 -2.5,-4.5; GND@1 4.5,4.5; GND@39 -5.5,-4.5; GND@47 -1.5,-4.5; GND@59 4.5,-4.5; RXI-0 3.5,4.5; SWDCK 4,3.7; SWDIO 0,3.7; TXO-0 0.5,4.5; ~AD31 -3,-3.7; ~AD35 -2,3.7; ~D4 -2.5,4.5; ~D5 -1,3.7; ~D18 -4.5,-4.5; ~D19 -5,-3.7; ~D22 -3.5,4.5; ~D23 -4,3.7; ~D24 -3,3.7; ~D27 -4.5,4.5; ~D28 -5.5,4.5; ~D37 3.5,-4.5; ~D39 3,3.7; ~D42 1.5,-4.5; ~D43 1,-3.7; ~D44 4,-3.7; ~D45 -2,-3.7; ~RST 0,-3.7 | smd 0.6 x 0.4: AD34 -6.5,-0.5; D15 -6.5,0.5; VDD@36 -5.7,-3; VDD@37 -6.5,-3.5; XI -6.5,-2.5; XO -5.7,-2; ~AD11 -5.7,-1; ~AD12 -5.7,2; ~AD13 -5.7,1; ~AD29 -6.5,-1.5; ~AD32 -5.7,3; ~AD33/SWO -5.7,0; ~D6 -6.5,3.5; ~D25 -6.5,2.5; ~D26 -6.5,1.5 | smd 0.6 x 0.6: GND@22 -6.5,4.5; GND@38 -6.5,-4.5
SOT23-5 = smd 0.55 x 1.2: 1 -0.95,-1.3; 2 0,-1.3; 3 0.95,-1.3; 4 0.95,1.3; 5 -0.95,1.3
MSOP10 = smd 1 x 0.3: 1 -2.25,1; 2 -2.25,0.5; 3 -2.25,0; 4 -2.25,-0.5; 5 -2.25,-1; 6 2.25,-1; 7 2.25,-0.5; 8 2.25,0; 9 2.25,0.5; 10 2.25,1
CRYSTAL-SMD-3.2X1.5MM = smd 1 x 1.8: P$1 -1.25,0; P$2 1.25,0

### Placement (x,y rotation side)
C1  30.73,5.71 0 top
C5  26.16,8.38 90 top
C6  28.57,9.4 0 top
C8  18.8,13.59 180 top
C9  19.18,7.75 0 top
C12  8.13,11.56 90 top
C13  1.78,11.05 90 top
C17  42.16,13.72 90 top
C18  37.34,14.35 270 top
C19  11.3,11.56 90 top
C20  34.8,13.33 0 top
C21  34.8,11.56 180 top
C22  9.4,8.26 180 top
C23  9.91,11.56 90 top
C28  34.67,17.15 0 top
D1  22.1,11.68 90 bottom
D2  26.92,11.68 90 bottom
D3  23.5,11.94 0 top
D4  23.62,9.78 0 top
D5  23.62,11.68 90 bottom
D6  28.57,11.68 90 bottom
D7  25.4,11.68 90 bottom
E1  30.86,2.79 0 top
J1  39.88,4.19 90 bottom
J2  1.02,17.27 0 top
J3  20.7,5.46 0 bottom
J4  31.75,12.32 270 top
J5  25.4,4.06 0 top
J7  1.14,3.81 0 top
J9  1.14,1.65 0 top
J10  36.96,14.35 270 bottom
J11  16.26,11.18 270 bottom
J12  41.4,5.46 270 top
J13  28.96,19.56 180 top
J14  25.53,1.65 0 top
R1  34.8,5.97 0 top
R3  20.95,4.06 0 top
R5  28.7,15.11 0 top
R6  24.26,13.97 180 top
R10  31.11,16.64 0 top
R11  39.75,8 180 top
R12  21.08,5.97 180 top
R13  40.01,20.07 180 top
R14  34.8,15.24 0 top
R15  34.8,9.65 180 top
R16  24.26,15.49 0 top
R17  34.8,7.87 180 top
S1  33.91,19.3 180 bottom
TP1  13.46,8.64 0 top
TP2  12.95,11.81 0 top
TP3  20.7,15.24 0 top
TP4  13.21,14.61 0 top
TP5  40.01,9.91 0 top
TP6  42.04,11.3 0 top
U1  4.83,10.54 0 bottom
U2  28.57,12.32 0 top
U3  19.18,10.79 180 top
U6  40.01,14.22 270 top
Y2  5.08,11.3 0 top

### Tracks (layer width: path | path; a pad name or v marks a point on that pad's centre or on a via)
3.3V  (via drill 0.35)  (1 unrouted)
  Top 0.152: R10.2 31.5,17.11 31.5,17.15 | R12.2 19.6,5.33 19.18,5.33 19.15,5.36 18.04,5.36 17.68,5.71 15.62,5.71 15.62,5.75 15.72,5.84 15.72,6.35 15.36,6.7 14.94,6.7 14.88,6.76 14.73,6.76 14.38,7.12 14.38,7.26 14.23,7.41 13.9,7.41 13.59,7.71 13.09,7.71 13,7.62 v12.57,7.62
  Top 0.305: E1.2 30.05,3 31.14,4.09 E1.5 31.59,4.09 30.73,4.95 30.73,5.18 30.63,5.29 30.63,5.32 C1.1 29.99,5.71 29.86,5.59 28.61,5.59 28.58,5.61 28.01,5.61 27.66,5.97 25.73,5.97 25.3,5.54 24.74,5.54 24.34,5.94 24.34,6.14 22.78,7.7 22.78,7.9 22.38,8.3 21.82,8.3 21.41,7.9 21.41,7.44 v20.95,6.98 20.95,6.69 R12.2 20.23,6.16 19.07,7.32 19.07,7.35 C9.1 18.68,8.04 19.41,8.78 19.52,8.78 19.92,9.18 19.92,9.29 U3.5 20.13,10.6 v21.08,11.56 | 41.49,13.42 40.81,14.1 39.24,14.1 | 41.49,13.42 42.04,12.87 | 42.04,12.87 | 39.24,14.1 38.44,14.1 C18.1 35.69,15.2 R14.2 35.65,15.79 36.38,16.52 36.38,16.87 36.62,17.12 36.62,17.68 36.07,18.24 36.07,18.42 35.51,18.97 34.64,18.97 33.62,17.95 33.15,17.95 32.97,17.77 32.97,17.64 R10.2 31.96,14.44 31.11,13.59 v31.03,13.68 | C17.1 42.04,12.87 | 41.49,13.42 41.01,12.94 U6.10 | U6.7 39.51,13.83 39.24,14.1 | v21.46,14.1 21.8,14.1 21.97,13.92 | 21.97,13.92 22.73,13.16 25.78,13.16 25.96,13.34 25.96,13.97 | 25.96,13.97 25.96,14.6 25.86,14.7 25.86,14.71 25.43,15.15 25.41,15.15 25.11,15.45 R16.2 | J2.9 21.97,16.64 21.97,13.92 | v12.57,7.62 11.94,8.26 C22.1 10.08,8.42 10.08,9.35 10.46,9.73 10.46,10.32 9.91,10.88 C23.1 C19.1 | v26.8,13.97 25.96,13.97
  Bottom 0.305: v20.95,6.98 21.2,6.74 J3.2 | U1.VDD@36 10.83,7.54 U1.VDD@37 11.92,7.04 12.16,7.29 12.24,7.29 v12.57,7.62 | v26.8,13.97 27.09,13.68 29.3,13.68 29.69,13.29 30.25,13.29 30.64,13.68 v31.03,13.68 | v21.08,11.56 21.08,13.13 21.31,13.36 21.31,13.95 v21.46,14.1
8
  Bottom 0.152: J7.1 1.14,5.04 1.75,5.65 1.75,5.82 1.83,5.89 U1.D38
10
  Bottom 0.152: J2.2 2.79,16.51 2.79,16.26 2.33,15.79 U1.D40
!RESET  (via drill 0.35)  (1 unrouted)
  Top 0.152: C20.2 35.65,13.54 R14.1 33.95,17.02 C28.1 33.82,17.18 v34.92,18.29 | v19.24,9.46 18.73,8.95 18.73,8.8 17.75,7.82 17.75,7.12 17.4,6.76 16.89,6.76 16.41,7.24 14.99,7.24 v14.99,7.37 | v14.99,7.75 14.99,8.26 15.37,8.64 J11.10 | v12.84,5.71 12.41,5.28 11.92,5.28 11.91,5.28 8.15,5.28 v6.82,5.28 | v15.11,6.1 14.76,6.45 14.61,6.45 13.96,7.1 v13.34,7.1
  Bottom 0.152: 35.81,18.5 35.14,18.5 v34.92,18.29 34.71,18.5 S1.4 30.99,17.63 30.99,15.24 30.61,14.86 27.3,14.86 27.15,15.01 27.15,15.24 26.71,15.68 24.64,15.68 24.58,15.62 24.13,15.62 23.88,15.88 J2.10 22.52,15.91 16.55,15.91 16.26,15.62 16.26,14.22 16.36,14.22 16.59,14.45 17.2,14.45 17.63,14.02 17.63,9.17 18.29,8.51 v19.24,9.46 | 29.34,5.84 27.18,5.84 26.87,6.15 26.67,6.15 24.82,8 22.57,8 22.35,8.23 22.09,8.23 21.21,9.12 21.17,9.16 21.17,9.94 21.37,10.14 21.37,10.41 21.19,10.59 20.94,10.59 20.52,10.18 20.52,9.12 20.25,8.86 20.25,8.35 20.72,7.89 19.68,6.86 19.23,6.86 19.18,6.91 18.11,6.91 18.01,7.01 16.2,7.01 15.62,7.59 J11.10 | U1.~RST 4.9,6.77 4.9,5.65 5.26,5.28 v6.82,5.28 | v12.84,5.71 13.34,6.21 v13.34,7.1 | 14.56,7.37 14.56,7.24 | 14.56,7.11 14.56,7.24 | v15.11,6.1 15.11,6.68 14.56,7.24 | 14.56,7.24 14.69,7.37 v14.99,7.37 v14.99,7.75
  Bottom 0.305: S1.3 35.81,18.5
!RTS
  Top 0.152: C21.1 33.95,13.26 C20.1 | C20.1 33.95,12.93 33.17,12.15 33.17,9.06 33.95,8.28 33.95,8 | U6.4 36.37,13.33 C20.1
  Top 0.305: R17.2 33.95,8
BOOT  (via drill 0.35)  (1 unrouted)
  Top 0.152: R15.2 34.16,9.65 34.42,9.91 34.42,11.09 C21.2 | v9.4,9.21 9.78,9.58 v9.78,10.04
  Bottom 0.152: U1.BOOT 3.4,14.97 3.4,13.85 6.6,10.64 7.24,10.64 7.59,10.28 7.59,9.86 9.1,8.35 9.4,8.64 v9.4,9.21 | v9.78,10.04 9.78,12.96 v9.73,13
GND  (via drill 0.35)  (25 unrouted)
  Top 0.152: J14.2 28.07,2.03 28.19,2.16 | C28.2 35.77,17.4 v35.94,17.4 | v18.52,14.22 18.67,14.22 18.3,13.85 C8.2 18.52,13.37 18.54,13.37 19.18,12.73 U3.2
  Bottom 0.152: U1.GND@59 1.52,7.24 v1.52,7.87
  pour Top: -4.06,23.5 48.39,23.5 48.39,-6.35 -4.06,-6.35
  pour Bottom: -4.06,23.62 50.04,23.62 50.04,-7.37 -4.06,-7.37
N$1  (via drill 0.35)  (1 unrouted)
  Top 0.152: R10.1 30.27,15.77 30.33,15.71 30.33,12.3 29.88,11.85 29.58,12.15 28.88,12.15 28.57,11.85
  Bottom 0.152: D6.A 28.57,11.12 v29.61,12.15
N$2  (via drill 0.35)
  Top 0.305: v25.15,14.46 25.15,14.01 R6.1
  Bottom 0.305: D2.C 26.58,12.91 26.4,12.91 25.15,14.16 v25.15,14.46
N$3  (via drill 0.35)
  Top 0.152: 26.59,12.14 26.54,12.19 25.78,12.19 25.84,12.14 26.29,12.14 26.59,12.14 | 26.95,11.78 27.04,11.68 v27.71,11.68 | v23.62,14.46 23.62,14.31 23.41,14.1 R6.2 | 26.59,12.14 26.95,11.78 | 26.95,11.78 26.95,11.7 U2.1
  Bottom 0.152: v27.71,11.68 27.65,11.74 27.65,13.07 27.43,13.29 26.55,13.29 26.04,13.81 26.04,14.43 25.4,15.07 24.89,15.07 24.56,14.73 23.62,14.73 v23.62,14.46
N$4
  Top 0.152: R5.2 28.45,14.01 28.45,13.97 28.1,13.62 U2.5
N$5  (via drill 0.35)
  Top 0.152: R1.1 33.27,5.97 32.77,6.48 32.77,8.38 32.79,8.41 33.02,8.64 33.02,8.78 32.87,8.93 32.87,11.2 J4.1 | 31.62,12.45 J4.1 | J4.1 31.75,11.94 31.11,11.3 | J4.1 31.75,11.43 30.2,9.88 30.2,8.8 30.07,8.67 29.5,8.67 28.19,7.37 28.04,7.37 26.95,8.45 25.04,8.45 24.23,9.27 24.23,10.06 22.89,11.4 22.89,12.45 22.13,13.21 20.95,13.21 20.63,13.53 v20.63,13.64 | v18.29,12.76 18.29,12.16 U3.3
  Bottom 0.152: v20.63,13.64 19.17,13.64 v18.29,12.76
N$6  (via drill 0.35)
  Top 0.152: Y2.P$2 6.28,11.36 | 6.28,11.36 4.55,13.08 2.67,13.08 1.78,12.19 C13.2 | v6.99,10.03 6.28,10.74 6.28,11.3 6.28,11.36
  Top 0.305: Y2.P$2 6.28,11.3
  Bottom 0.152: v6.99,10.03 8.98,8.04 U1.XI
N$7  (1 unrouted)
  Top 0.152: 3.88,11.25 6.12,9.02 8.13,9.02 8.86,9.75 8.86,11.35 8.72,11.49 7.53,11.49 7.51,11.47 7.26,11.47 7.06,11.67 7.06,12.3 6.92,12.43 6.19,12.43 5.79,12.83 5.79,13.08 5.97,13.26 6.22,13.26 6.44,13.04 7.18,13.04 7.81,12.41 C12.2
  Top 0.305: Y2.P$1 3.88,11.25
N$8  (2 unrouted)
N$9  (via drill 0.35)
  Top 0.152: R3.1 21.12,5.08 22.99,5.08 23.37,5.46 v23.37,5.97 | v20.95,8.51 20.7,8.51 20.8,8.6 v20.86,8.6 | v23.05,8.7 25.02,6.73 v25.02,6.22
  Bottom 0.152: v20.95,8.51 20.95,8.38 21.49,7.85 21.49,7.37 21.85,7.01 22.32,7.01 v23.37,5.97 24.77,5.97 v25.02,6.22 | D1.A 22.1,9.02 21.97,8.89 22.33,8.53 22.48,8.53 22.68,8.33 v23.05,8.7
N$10  (via drill 0.35)
  Top 0.305: v40.51,17.4 U6.2
  Bottom 0.305: J10.A7 37.34,14.15 37.92,14.15 38.56,14.78 | 38.56,14.78 39.32,15.54 40.26,15.54 40.51,15.8 v40.51,17.4 | J10.B7 38.24,15.1 38.56,14.78
N$11  (1 unrouted)
N$12  (via drill 0.35)
  Top 0.305: R13.2 39.16,16.8 v38.35,16
  Bottom 0.305: v38.35,16 37.95,15.6 J10.A5
N$13  (via drill 0.35)
  Top 0.152: v22.86,15 22.91,15 R16.1
  Bottom 0.152: D7.A 24.35,11.86 24.35,13.07 24.13,13.29 23.54,13.29 22.61,14.22 22.61,14.75 v22.86,15
N$14  (via drill 0.35)  (1 unrouted)
  Top 0.152: v22.1,7.62 22.1,6.13 R12.1
  Bottom 0.152: 26.86,5.54 24.7,7.7 22.94,7.7 22.86,7.62 v22.1,7.62 | 29.46,5.54 29.64,5.72 29.64,5.97 29.46,6.15 27.3,6.15 27,6.45 26.8,6.45 24.95,8.31 23.7,8.31 23.62,8.38 23.62,8.41 23.66,8.45 23.66,8.95 23.62,8.99 D5.A
PDMCLK  (1 unrouted)
PDMDATA  (via drill 0.35)  (1 unrouted)
  Top 0.152: 7.56,4.51 8,4.95 8.25,4.95 8.28,4.98 11.79,4.98 13.36,4.98 14.83,4.98 15.14,4.67 15.59,4.67 15.9,4.98 16.87,4.98 17.55,4.29 17.55,4.24 19.38,2.41 21.46,2.41 22.1,3.05 24.76,3.05 24.92,2.9 25.88,2.9 26.57,3.58 26.57,4.34 27.46,5.23 28.42,5.23 29.56,4.09 E1.1 | 7.56,4.51 7.39,4.34 | 7.56,4.51 7.49,4.57 v7.49,4.62
  Bottom 0.152: v7.49,4.62 7.49,5.51 | U1.D36 2.4,6.11 2.4,7.24 2.53,7.37 7.12,7.37 7.25,7.24 7.25,6.78 7.4,6.63 7.4,6.67
RXI-0  (via drill 0.35)
  Top 0.152: TP5.1 U6.8 40.01,10.67 v40.02,10.65 | v28.7,6.86 28.83,6.98 v31.88,6.98
  Bottom 0.152: v28.7,6.86 28.45,6.6 27.28,6.6 27.12,6.76 26.93,6.76 25.07,8.61 25.04,8.61 24.89,8.76 24.89,10.08 24.67,10.3 24.67,11.11 23.95,11.83 23.95,12.24 D5.C | v31.88,6.98 36.58,6.98 36.7,6.86 36.96,6.86 37.59,7.49 37.59,8.51 | 37.59,8.51 37.59,8.64 | 37.59,8.51 38.38,9.3 38.72,9.3 39.15,9.73 39.15,9.78 v40.02,10.65
SHLD  (via drill 0.35)  (4 unrouted)
  Top 0.152: J10.SHLD3 J10.SHLD5 41.38,18 41.38,15.88 41.25,15.74 41.02,15.74 v40.13,14.86 | J10.SHLD7 41.35,10.03 40.36,9.04 39.65,9.04 38.66,10.03 J10.SHLD2
  Bottom 0.152: v40.13,14.86 40.13,11.95 41.73,10.36
  Bottom 0.305: J10.SHLD7 41.73,10.36
SWDCK  (via drill 0.35)  (1 unrouted)
  Top 0.152: TP1.1 13.08,9.02 13.51,9.45 13.51,10.72 v13.97,11.18
  Bottom 0.152: v13.97,11.18 15.24,12.45 J11.4
SWDIO  (via drill 0.35)
  Top 0.152: v13.72,12.45 13.59,12.45 TP2.1 12.02,11.81 11.83,12 11.83,12.45 10.68,13.61 9.48,13.61 9.13,13.25 9.13,12.05 8.86,11.78 8.85,11.79 7.41,11.79 7.39,11.77 7.36,11.8 7.36,12.42 7.05,12.74 6.31,12.74 v6.1,12.95
  Bottom 0.152: v13.72,12.45 14.37,12.45 15.62,13.7 J11.2 | v6.1,12.95 4.83,14.22 U1.SWDIO
TXO-0  (1 unrouted)
  Top 0.152: U6.9 40.51,11.31 40.64,11.18 41.91,11.18 TP6.1
V_BATT  (via drill 0.35)
  Top 0.152: v28.19,8.38 27.73,8.85 C6.1 | C6.1 28.52,10.19 28.95,10.19 29.08,10.32 29.08,10.57 29.45,10.94 | C6.1 27.37,9.4 26.76,10.01 25.57,10.01 25.34,9.78 D4.A
  Top 0.305: U2.3 29.45,10.94
  Bottom 0.152: J1.2 31.39,5.19 v28.19,8.38 | J12.2 41.02,2.92 38.75,5.19 37.08,5.19
  Bottom 0.305: J1.2 37.08,5.19
V_USB  (via drill 0.35)
  Top 0.152: v27.18,7.37 26.33,7.37 C5.1 | v26.34,11.53 26.32,11.53 26.16,11.68 24.9,11.68 D3.A 25.28,12.57 28.57,12.57 29.52,13.52 U2.4 29.88,13.97 v29.97,13.97
  Bottom 0.152: v27.18,7.37 27.18,10.55 D2.A 26.34,11.39 v26.34,11.53 | J10.VBUS2 36.99,11.9 36.2,12.7 36.2,14.22 | 36.98,16.76 | 36.98,16.76 36.98,16.8 | 36.2,14.22 36.2,15.97 36.34,16.11 | 36.34,16.11 36.98,16.76 | 36.98,16.76 37.02,16.8 J10.VBUS1 37.26,16.76 36.98,16.76 | 36.61,16.11 36.34,16.11 | 36.2,14.22 31.34,14.22 31.28,14.28 30.29,14.28 v29.97,13.97
VIN  (via drill 0.35)
  Top 0.152: C8.1 19.43,13.59 | 19.43,13.59 19.68,13.59 20.07,13.21 20.07,12.16 U3.1 21.08,12.1 | 21.08,12.1 22.19,12.1 D3.C | 21.08,12.1 21.24,11.94 21.46,11.71 21.46,11.4 21.08,11.02 21.08,10.16 21.46,9.78 D4.C 22.95,9.31 23.3,9.31 23.66,8.95 23.66,8.52 25.83,6.35 27.81,6.35 28.17,5.99 28.74,5.99 28.77,5.97 29.57,5.97 29.84,6.24 31.63,6.24 32.63,5.24 34.59,5.24 35.32,5.97 35.43,5.97 | v26.54,14.99 27.07,15.52 27.07,15.71 27.51,16.14 v29.18,16.14 | v19.43,14.48 19.43,13.59
  Top 0.305: R1.2 35.43,5.97
  Bottom 0.152: J2.12 29.18,17.04 v29.18,16.14 | v19.43,14.48 20.02,15.07 22.07,15.07 22.61,15.61 23.11,15.61 23.65,15.07 24.46,15.07 24.77,15.38 25.52,15.38 25.91,14.99 v26.54,14.99
~4
  Bottom 0.152: J7.5 11.56,3.56 11.56,3.43 11.3,3.68 J7.5 | J7.5 10.67,3.81 9.53,4.95 9.4,4.95 9.33,5.03 U1.~D18
~6
  Bottom 0.152: J7.3 5.08,4.95 4.32,4.95 4.17,5.1 4.04,5.1 3.81,5.33 3.81,6.83 U1.~D43
~7
  Bottom 0.152: J7.2 3.33,4.17 U1.~D42
~9
  Bottom 0.152: U1.~D39 1.83,16.46 1.09,17.2 1.09,17.27 J2.1
~11
  Bottom 0.152: J2.3 5.83,17 U1.~D5
~12
  Bottom 0.152: J2.4 8.38,17.27 6.98,15.87 6.91,15.87 6.59,15.56 6.59,15.31 U1.D7
~13  (via drill 0.35)
  Top 0.152: v12.29,16.61 12.83,16.08 12.83,15.75 13.11,15.47 13.57,15.47 14.48,14.56 v14.48,14.48
  Bottom 0.152: J2.5 11.68,17.27 12.32,16.64 v12.29,16.61 | U1.~D6 12.25,14.04 12.47,13.81 13.21,13.81 13.71,14.31 14.21,14.31 14.3,14.22 14.48,14.22 v14.48,14.48
~A0  (1 unrouted)
~A1  (1 unrouted)
  Top 0.152: J5.1 26.04,4.06
  Bottom 0.152: 13.31,10.29 10.67,10.29 10.54,10.41 10.54,10.53 U1.~AD33/SWO | 13.31,10.29 14.22,10.29 15.11,11.18 J11.6 | -7.87,7.24 -7.87,7.87 | 13.31,10.29 17.02,6.58 17.02,5.71 17.65,5.08 18.28,5.08 18.81,4.56 19.24,4.13 | 19.3,4.06 19.24,4.13 | 19.24,4.13 25.34,4.13 J5.1
~A2
  Bottom 0.152: U1.~AD11 10.48,9.5 13.21,9.5 14.25,8.45 14.25,5.94 J7.7
~A3
  Bottom 0.152: U1.~AD29 11.48,8.89 13.16,8.89 13.95,8.1 13.95,5.92 13.74,5.71 13.74,5.21 13.84,5.11 J7.6
~A5
  Bottom 0.152: U1.~AD31 7.95,6.71 7.95,5.02 8.1,4.87 8.1,4.47 J7.4
~A14
  Bottom 0.152: U1.~AD35 6.83,15.08 6.9,15.15 6.9,15.44 7.03,15.57 7.32,15.57 7.85,16.1 9.28,16.1 9.65,16.48 10.31,16.48 10.79,16.01 12.55,16.01 12.9,16.36 12.9,16.46 J2.6
~A15  (via drill 0.35)
  Top 0.152: J2.7 14.73,15.75 v14.61,15.75
  Bottom 0.152: U1.~AD32 10.53,14.08 10.92,14.48 13.34,14.48 13.69,14.84 13.69,15.26 13.28,15.67 13.28,16.1 14.25,16.1 v14.61,15.75 | v14.61,15.75
~A16  (via drill 0.35)  (1 unrouted)
  Top 0.152: J2.8 17.53,16 15.75,16 15.38,15.63 v15.38,14.87 v15.37,14.86
  Top 0.305: 18.54,17.02 18.16,17.02
  Bottom 0.152: v15.38,14.87 15.68,14.56 13.69,12.57 10.59,12.57 10.59,12.6 U1.~AD12
~D19  (via drill 0.35)
  Top 0.152: v12.45,6.6 12.98,6.6 13.09,6.5 13.74,6.5 14.18,6.07 14.28,6.07 14.86,5.49 15.18,5.49 15.39,5.28 16.99,5.28 17.86,4.42 17.86,4.37 18.16,4.06 18.41,4.06 19.68,2.79 21.41,2.79 21.8,3.19 R3.2
  Bottom 0.152: v12.45,6.6 10.06,6.6 U1.~D19
~D25  (via drill 0.35)  (1 unrouted)
  Top 0.152: v17.14,7.37 17.02,7.37 14.88,9.5 14.88,12.79 v13.96,13.71 | TP3.1 19.02,15.24 18.61,14.83 18.27,14.83 17.91,14.47 17.91,14.13 17.63,13.84 17.63,8.33 17.2,7.9 16.76,7.9 16.76,7.75
  Bottom 0.152: U1.~D25 11.62,13.33 13.72,13.33 13.96,13.58 v13.96,13.71 | J3.3 19.73,5.93 19.73,6.23 19.6,6.37 19.3,6.37 19.06,6.6 17.91,6.6 v17.14,7.37
~D27  (via drill 0.35)  (3 unrouted)
  Top 0.152: v9.91,15.88 12.06,15.88 12.32,15.62 12.32,15.49 TP4.1 13.21,13.29 12.14,12.21 | v18.29,5.97 17.97,5.97 17.49,6.45 16.05,6.45 v15.87,6.63 | 12.79,9.34 12,9.34 11.81,9.53 11.56,9.53 11.43,9.4 | 12.57,8.26 12.6,8.23 12.65,8.23 12.6,8.28 12.6,8.38 12.57,8.38 | 12.57,8.26
  Bottom 0.152: v9.91,15.88 9.91,15.62 U1.~D27 | v18.29,5.97 18.69,5.97 J3.4 | v15.87,6.63 15.85,6.63 15.75,6.73
(copper drawn outside any net)
  shapes: Top area x2